# Altium project science_board_proj_rev_1.PrjPcb
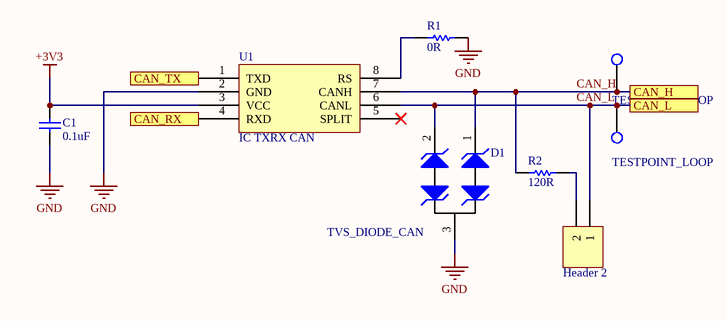
[diagram p0: can.SchDoc]
4 sheets, 88 parts. Net scope: flat (ports and power ports of the same name join across sheets).
Board file: science_board_pcb.PcbDoc
Sheets:
  can.SchDoc
  connectors.SchDoc
  power.SchDoc
  support.SchDoc

## Sheet can.SchDoc: Science Board CAN
size A4

### Parts
1  Header 2  [HDR1X2]
C1  value 0.1uF  [CAPC0603(1608)55_N]  (hidden comment: CAP_0.1uF_16V_0603)
CANH1  TESTPOINT_LOOP  [TESTPOINT_LOOP]
CANL1  TESTPOINT_LOOP  [TESTPOINT_LOOP]
D1  TVS_DIODE_CAN  [TVS_DIODE_CAN]
R1  value 0R  [RESC0603(1608)_N]  (hidden comment: RES_0R_0603)
R2  value 120R  [RESC0603(1608)_N]  (hidden comment: RES_120R_0603)
U1  IC TXRX CAN  [LT-S8_N]

### Ports
CAN_H, CAN_L, CAN_RX, CAN_TX

### Nets
+3V3: C1.2 U1.3(VCC)
GND: C1.1 D1.3 R1.2 U1.2(GND)
CAN_H: CANH1.1(=value) D1.1 R2.1 U1.7(CANH) ; port CAN_H
CAN_L: 1.1 CANL1.1(=value) D1.2 U1.6(CANL) ; port CAN_L
Net1_2: 1.2 R2.2
NetR1_1: R1.1 U1.8(RS)
NetU1_1: U1.1(TXD) ; port CAN_TX
NetU1_4: U1.4(RXD) ; port CAN_RX

Not connected (* = marked no-connect by the designer): U1 5(SPLIT)*

### Library data of the parts
1 = Header 2: Header, 2-Pin; LatestRevisionDate: 17-Jul-2002; LatestRevisionNote: Re-released for DXP Platform.; Publisher: Altium Limited
C1 = CAP_0.1uF_16V_0603: CAP CER 0.1UF 16V X7R 0603; Manufacturer: Yageo; MPN: CC0603KRX7R7BB104; Dimensions: 0.063" L x 0.031" W (1.60mm x 0.80mm); Package: 0603 (1608 Metric); Temperature Coefficient: X7R; Voltage Rating: 16V; Digikey Part Number: 311-1088-1-ND
D1 = TVS_DIODE_CAN: TVS DIODE 24V 41V SOT323-3; Manufacturer: Nexperia USA Inc.; MPN: PESD2CAN,215; Package: SC-70, SOT-323; ComponentLink1Description: Datasheet; ComponentLink1URL: https://assets.nexperia.com/documents/data-sheet/PESD1CAN-U.pdf; Digikey Part Number: 1727-3891-1-ND
R1 = RES_0R_0603: RES SMD 0 OHM JUMPER 1/10W 0603; Manufacturer: Yageo; MPN: RC0603JR-070RL; Package: 0603 (1608 Metric); Dimensions: 0.063" L x 0.031" W (1.60mm x 0.80mm); Digikey Part Number: 311-0.0GRCT-ND
R2 = RES_120R_0603: RES SMD 120 OHM 5% 1/10W 0603; Manufacturer: Yageo; MPN: RC0603JR-07120RL; Package: 0603 (1608 Metric); Dimensions: 0.063" L x 0.031" W (1.60mm x 0.80mm); Tolerance: 5%; Digikey Part Number: 311-120GRCT-ND
U1 = LTC2875: IC TXRX CAN 4MBPS 8SO; Manufacturer: Linear Technologies; MPN: LTC2875IS8#PBF; Package: 8-SOIC (0.154", 3.90mm Width); ComponentLink1Description: Datasheet; ComponentLink1URL: https://www.analog.com/media/en/technical-documentation/data-sheets/2875f.pdf; Digikey Part Number: LTC2875IS8#PBF-ND

## Sheet connectors.SchDoc: Science Board Connectors
size A4; DrawnBy: Adrianna Ascalon
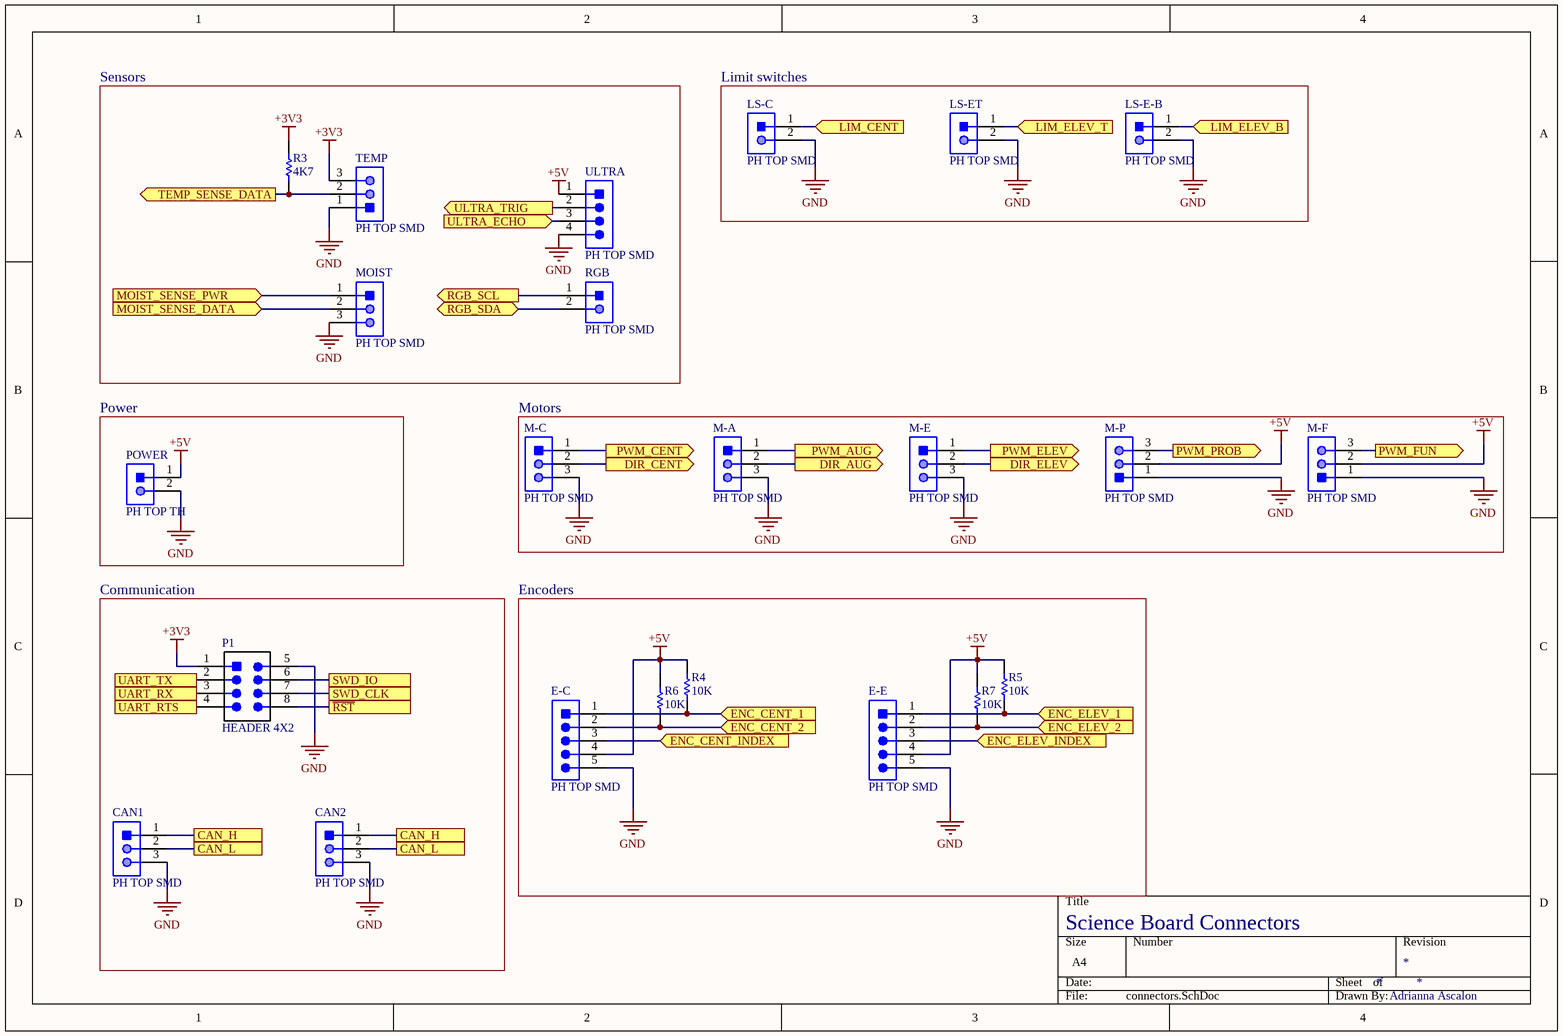
[diagram p1: connectors.SchDoc]

### Parts
CAN1  PH TOP SMD  [JST-B3B-SM4-TB]
CAN2  PH TOP SMD  [JST-B3B-SM4-TB]
E-C  PH TOP SMD  [JST-B5B-SM4-TB]
E-E  PH TOP SMD  [JST-B5B-SM4-TB]
LS-C  PH TOP SMD  [JST-B2B-SM4-TB]
LS-E-B  PH TOP SMD  [JST-B2B-SM4-TB]
LS-ET  PH TOP SMD  [JST-B2B-SM4-TB]
M-A  PH TOP SMD  [JST-B3B-SM4-TB]
M-C  PH TOP SMD  [JST-B3B-SM4-TB]
M-E  PH TOP SMD  [JST-B3B-SM4-TB]
M-F  PH TOP SMD  [JST-B3B-SM4-TB]
M-P  PH TOP SMD  [JST-B3B-SM4-TB]
MOIST  PH TOP SMD  [JST-B3B-SM4-TB]
P1  HEADER 4X2  [HEADER_2X4]
POWER  PH TOP TH  [JST-B2B-PHSK]
R3  value 4K7  [RESC0603(1608)_N]  (hidden comment: RES_4K7_0603)
R4  value 10K  [RESC0603(1608)_N]  (hidden comment: RES_10K_0603)
R5  value 10K  [RESC0603(1608)_N]  (hidden comment: RES_10K_0603)
R6  value 10K  [RESC0603(1608)_N]  (hidden comment: RES_10K_0603)
R7  value 10K  [RESC0603(1608)_N]  (hidden comment: RES_10K_0603)
RGB  PH TOP SMD  [JST-B2B-SM4-TB]
TEMP  PH TOP SMD  [JST-B3B-SM4-TB]
ULTRA  PH TOP SMD  [JST-B4B-SM4-TB]

### Blocks framed on the sheet
Sensors: MOIST R3 RGB TEMP ULTRA
Limit switches: LS-C LS-E-B LS-ET
Power: POWER
Motors: M-A M-C M-E M-F M-P
Communication: CAN1 CAN2 P1
Encoders: E-C E-E R4-R7

### Ports
CAN_H, CAN_L, DIR_AUG (out), DIR_CENT (out), DIR_ELEV (out), ENC_CENT_1 (in), ENC_CENT_2 (in), ENC_CENT_INDEX (in), ENC_ELEV_1 (in), ENC_ELEV_2 (in), ENC_ELEV_INDEX (in), LIM_CENT (in), LIM_ELEV_B (in), LIM_ELEV_T (in), MOIST_SENSE_DATA (in), MOIST_SENSE_PWR (in), PWM_AUG (out), PWM_CENT (out), PWM_ELEV (out), PWM_FUN (out), PWM_PROB (out), RGB_SCL (out), RGB_SDA (bidir), SWD_CLK, SWD_IO, TEMP_SENSE_DATA (out), UART_RTS, UART_RX (in), UART_TX (out), ULTRA_ECHO (in), ULTRA_TRIG (out), ~{RST}

### Nets
+3V3: P1.1(VCC) R3.2 TEMP.3
+5V: E-C.4 E-E.4 M-F.2 M-P.2 POWER.1 R4.2 R5.2 R6.2 R7.2 ULTRA.1
GND: CAN1.3 CAN2.3 E-C.5 E-E.5 LS-C.2 LS-E-B.2 LS-ET.2 M-A.3 M-C.3 M-E.3 M-F.1 M-P.1 MOIST.3 P1.5(GND) POWER.2 TEMP.1 ULTRA.4
CAN_H: CAN1.1 CAN2.1 ; port CAN_H
CAN_L: CAN1.2 CAN2.2 ; port CAN_L
NetE-C_1: E-C.1 R4.1 ; port ENC_CENT_1
NetE-C_2: E-C.2 R6.1 ; port ENC_CENT_2
NetE-C_3: E-C.3 ; port ENC_CENT_INDEX
NetE-E_1: E-E.1 R5.1 ; port ENC_ELEV_1
NetE-E_2: E-E.2 R7.1 ; port ENC_ELEV_2
NetE-E_3: E-E.3 ; port ENC_ELEV_INDEX
NetLS-C_1: LS-C.1 ; port LIM_CENT
NetLS-E-B_1: LS-E-B.1 ; port LIM_ELEV_B
NetLS-ET_1: LS-ET.1 ; port LIM_ELEV_T
NetM-A_1: M-A.1 ; port PWM_AUG
NetM-A_2: M-A.2 ; port DIR_AUG
NetM-C_1: M-C.1 ; port PWM_CENT
NetM-C_2: M-C.2 ; port DIR_CENT
NetM-E_1: M-E.1 ; port PWM_ELEV
NetM-E_2: M-E.2 ; port DIR_ELEV
NetM-F_3: M-F.3 ; port PWM_FUN
NetM-P_3: M-P.3 ; port PWM_PROB
NetMOIST_1: MOIST.1 ; port MOIST_SENSE_PWR
NetMOIST_2: MOIST.2 ; port MOIST_SENSE_DATA
NetP1_2: P1.2 ; port UART_TX
NetP1_3: P1.3 ; port UART_RX
NetP1_4: P1.4 ; port UART_RTS
NetP1_6: P1.6 ; port SWD_IO
NetP1_7: P1.7 ; port SWD_CLK
NetP1_8: P1.8 ; port ~{RST}
NetR3_1: R3.1 TEMP.2 ; port TEMP_SENSE_DATA
NetR17_1: RGB.1 ; port RGB_SCL
NetR18_1: RGB.2 ; port RGB_SDA
NetUE_1: ULTRA.3 ; port ULTRA_ECHO
NetULTRA_2: ULTRA.2 ; port ULTRA_TRIG

### Library data of the parts
CAN1 CAN2 M-A M-C M-E M-F M-P MOIST TEMP = CON_3M_PH_TOP_SMT: CONN HEADER PH TOP 3POS 2MM SMD; Manufacturer: JST; Part Number: B3B-PH-SM4-TB; ComponentLink1Description: Datasheet; ComponentLink1URL: http://www.jst-mfg.com/product/pdf/eng/ePH.pdf
E-C E-E = CON_5M_PH_TOP_SMT: CONN HEADER PH TOP 5POS 2MM SMD; Manufacturer: JST; Part Number: B5B-PH-SM4-TB; ComponentLink1Description: Datasheet; ComponentLink1URL: http://www.jst-mfg.com/product/pdf/eng/ePH.pdf
LS-C LS-E-B LS-ET RGB = CON_2M_PH_TOP_SMT: CONN HEADER PH TOP 2POS 2MM SMD; Manufacturer: JST; Part Number: B2B-PH-SM4-TB; ComponentLink1Description: Datasheet; ComponentLink1URL: http://www.jst-mfg.com/product/pdf/eng/ePH.pdf
P1 = HEADER 4X2: Header, 4-Pin Dual row; MPN: GRPB042VWVN-RC; Manufacturer: Sullins Connector Solutions; Digikey Part Number: S9015E-04-ND
POWER = CON_2M_PH_TOP_TH: CONN HEADER PH TOP 2POS 2MM; Manufacturer: JST; Part Number: B2B-PH-K-S; ComponentLink1Description: Datasheet; ComponentLink1URL: http://www.jst-mfg.com/product/pdf/eng/ePH.pdf
R3 = RES_4K7_0603: RES SMD 4.7K OHM 5% 1/10W 0603; Manufacturer: Yageo; MPN: RC0603JR-074K7L; Package: 0603 (1608 Metric); Dimensions: 0.063" L x 0.031" W (1.60mm x 0.80mm); Tolerance: 5%; Digikey Part Number: 311-4.7KGRCT-ND
R4-R7 = RES_10K_0603: RES SMD 10K OHM 5% 1/10W 0603; Manufacturer: Yageo; MPN: RC0603JR-0710KL; Package: 0603 (1608 Metric); Dimensions: 0.063" L x 0.031" W (1.60mm x 0.80mm); Tolerance: 5%; Digikey Part Number: 311-10KGRCT-ND
ULTRA = CON_4M_PH_TOP_SMT: CONN HEADER PH TOP 4POS 2MM SMD; Manufacturer: JST; Part Number: B4B-PH-SM4-TB; ComponentLink1Description: Datasheet; ComponentLink1URL: http://www.jst-mfg.com/product/pdf/eng/ePH.pdf

## Sheet power.SchDoc: Power
size A4; DrawnBy: Adrianna Ascalon
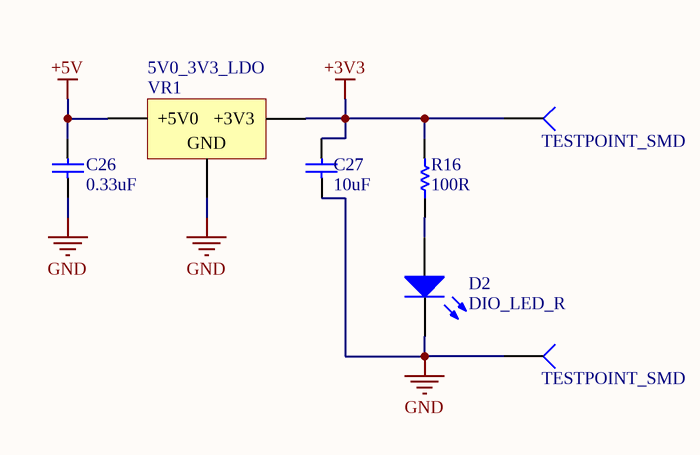
[diagram p2: power.SchDoc]

### Parts
3V3  TESTPOINT_SMD  [TESTPOINT]
C26  value 0.33uF  [CAPC0603(1608)55_N]  (hidden comment: CAP_0.33uF_16V_0603)
C27  10uF  [AVX-CAPC3528_V]
D2  DIO_LED_R  [LED_0805_LINE]
GND  TESTPOINT_SMD  [TESTPOINT]
R16  value 100R  [RESC0603(1608)_N]  (hidden comment: RES_100R_0603)
VR1  5V0_3V3_LDO  [VOLTAGE_REGULATOR]

### Nets
+3V3: 3V3.1(=value) C27.2 R16.2 VR1.2(+3V3)
+5V: C26.2 VR1.3(+5V0)
GND: C26.1 C27.1 D2.2(K) GND.1(=value) VR1.1(GND)
NetD2_1: D2.1(A) R16.1

### Library data of the parts
C26 = CAP_0.33uF_16V_0603: CAP CER 0.33UF 16V X7R 0603; Manufacturer: Murata Electronics North America; MPN: GCM188R71C334KA37D; Dimensions: 0.063" L x 0.031" W (1.60mm x 0.80mm); Package: 0603 (1608 Metric); Temperature Coefficient: X7R; Voltage Rating: 16V; Digikey Part Number: 490-6050-1-ND
C27 = CAP_10uF_0603: CAP CER 10UF 10V X5R 0603; Manufacturer: Yageo; MPN: CC0603MRX5R6BB106; Dimensions: 0.063" L x 0.031" W (1.60mm x 0.80mm); Package: 0603 (1608 Metric); Voltage Rating: 10V; Value: 10uF; Digikey Part Number: 311-1817-1-ND
D2 = DIO_LED_R: LED RED DIFFUSED 0805 SMD; Manufacturer: OSRAM; MPN: LS R976-NR-1; Forward Voltage Drop: 2V; Package: 0805 (2012 Metric); Digikey Part Number: 475-1278-1-ND
R16 = RES_100R_0603: RES SMD 100 OHM 1% 1/10W 0603; Manufacturer: Yageo; MPN: RC0603FR-07100RL; Package: 0603 (1608 Metric); Dimensions: 0.063" L x 0.031" W (1.60mm x 0.80mm); Tolerance: 1%; Digikey Part Number: 311-100HRCT-ND
VR1 = 5V0_3V3_LDO: IC REG LINEAR 3.3V 1A DPAK; Manufacturer: ON Semiconductor; MPN: NCP1117DT33T5G; Current Output: 1A; Digikey Part Number: NCP1117DT33T5GOSCT-ND
3V3 GND = TESTPOINT_SMD: Part Number (MPN): *

## Sheet support.SchDoc: Support
size A4; DrawnBy: Adrianna Ascalon
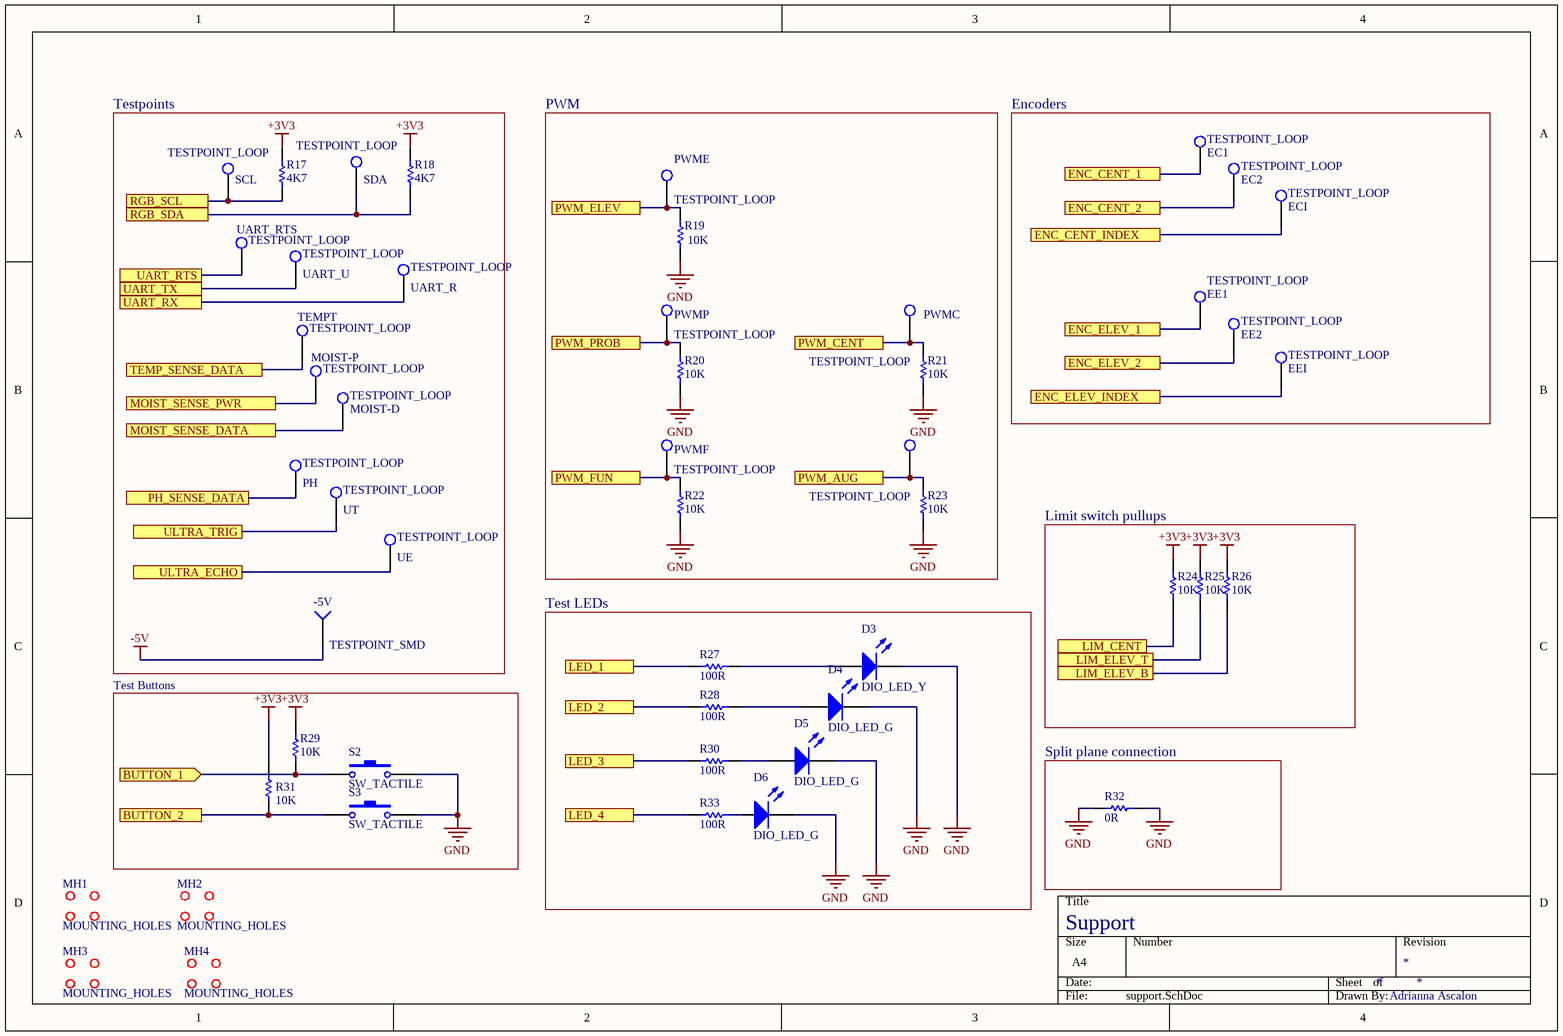
[diagram p3: support.SchDoc]

### Parts
-5V  TESTPOINT_SMD  [TESTPOINT]
D3  DIO_LED_Y  [LED_0805_LINE]
D4  DIO_LED_G  [LED_0805_LINE]
D5  DIO_LED_G  [LED_0805_LINE]
D6  DIO_LED_G  [LED_0805_LINE]
EC1  TESTPOINT_LOOP  [TESTPOINT_LOOP]
EC2  TESTPOINT_LOOP  [TESTPOINT_LOOP]
ECI  TESTPOINT_LOOP  [TESTPOINT_LOOP]
EE1  TESTPOINT_LOOP  [TESTPOINT_LOOP]
EE2  TESTPOINT_LOOP  [TESTPOINT_LOOP]
EEI  TESTPOINT_LOOP  [TESTPOINT_LOOP]
MH1  MOUNTING_HOLES  [MOUNTING_HOLE]
MH2  MOUNTING_HOLES  [MOUNTING_HOLE]
MH3  MOUNTING_HOLES  [MOUNTING_HOLE]
MH4  MOUNTING_HOLES  [MOUNTING_HOLE]
MOIST-D  TESTPOINT_LOOP  [TESTPOINT_LOOP]
MOIST-P  TESTPOINT_LOOP  [TESTPOINT_LOOP]
PH  TESTPOINT_LOOP  [TESTPOINT_LOOP]
PWMA  TESTPOINT_LOOP  [TESTPOINT_LOOP]
PWMC  TESTPOINT_LOOP  [TESTPOINT_LOOP]
PWME  TESTPOINT_LOOP  [TESTPOINT_LOOP]
PWMF  TESTPOINT_LOOP  [TESTPOINT_LOOP]
PWMP  TESTPOINT_LOOP  [TESTPOINT_LOOP]
R17  value 4K7  [RESC0603(1608)_N]  (hidden comment: RES_4K7_0603)
R18  value 4K7  [RESC0603(1608)_N]  (hidden comment: RES_4K7_0603)
R19  value 10K  [RESC0603(1608)_N]  (hidden comment: RES_10K_0603)
R20  value 10K  [RESC0603(1608)_N]  (hidden comment: RES_10K_0603)
R21  value 10K  [RESC0603(1608)_N]  (hidden comment: RES_10K_0603)
R22  value 10K  [RESC0603(1608)_N]  (hidden comment: RES_10K_0603)
R23  value 10K  [RESC0603(1608)_N]  (hidden comment: RES_10K_0603)
R24  value 10K  [RESC0603(1608)_N]  (hidden comment: RES_10K_0603)
R25  value 10K  [RESC0603(1608)_N]  (hidden comment: RES_10K_0603)
R26  value 10K  [RESC0603(1608)_N]  (hidden comment: RES_10K_0603)
R27  value 100R  [RESC0603(1608)_N]  (hidden comment: RES_100R_0603)
R28  value 100R  [RESC0603(1608)_N]  (hidden comment: RES_100R_0603)
R29  value 10K  [RESC0603(1608)_N]  (hidden comment: RES_10K_0603)
R30  value 100R  [RESC0603(1608)_N]  (hidden comment: RES_100R_0603)
R31  value 10K  [RESC0603(1608)_N]  (hidden comment: RES_10K_0603)
R32  value 0R  [RESC0603(1608)_N]  (hidden comment: RES_0R_0603)
R33  value 100R  [RESC0603(1608)_N]  (hidden comment: RES_100R_0603)
S2  SW_TACTILE  [B3U-1100P]
S3  SW_TACTILE  [B3U-1100P]
SCL  TESTPOINT_LOOP  [TESTPOINT_LOOP]
SDA  TESTPOINT_LOOP  [TESTPOINT_LOOP]
TEMPT  TESTPOINT_LOOP  [TESTPOINT_LOOP]
UART_R  TESTPOINT_LOOP  [TESTPOINT_LOOP]
UART_RTS  TESTPOINT_LOOP  [TESTPOINT_LOOP]
UART_U  TESTPOINT_LOOP  [TESTPOINT_LOOP]
UE  TESTPOINT_LOOP  [TESTPOINT_LOOP]
UT  TESTPOINT_LOOP  [TESTPOINT_LOOP]

### Blocks framed on the sheet
Testpoints: -5V MOIST-D MOIST-P PH R17 R18 SCL SDA TEMPT UART_R UART_RTS UART_U UE UT
PWM: PWMA PWMC PWME PWMF PWMP R19-R23
Encoders: EC1 EC2 ECI EE1 EE2 EEI
Limit switch pullups: R24-R26
Test LEDs: D3-D6 R27 R28 R30 R33
Test Buttons: R29 R31 S2 S3
Split plane connection: R32

### Ports
BUTTON_1 (in), BUTTON_2, ENC_CENT_1, ENC_CENT_2, ENC_CENT_INDEX, ENC_ELEV_1, ENC_ELEV_2, ENC_ELEV_INDEX, LED_1, LED_2, LED_3, LED_4, LIM_CENT, LIM_ELEV_B, LIM_ELEV_T, MOIST_SENSE_DATA, MOIST_SENSE_PWR, PH_SENSE_DATA, PWM_AUG, PWM_CENT, PWM_ELEV, PWM_FUN, PWM_PROB, RGB_SCL, RGB_SDA, TEMP_SENSE_DATA, UART_RTS, UART_RX, UART_TX, ULTRA_ECHO, ULTRA_TRIG

### Nets
+3V3: R17.2 R18.2 R24.2 R25.2 R26.2 R29.2 R31.1
-5V: -5V.1(=value)
GND: D3.2(K) D4.2(K) D5.2(K) D6.2(K) R19.1 R20.1 R21.1 R22.1 R23.1 R32.1 R32.2 S2.2 S3.2
NetD3_1: D3.1(A) R27.2
NetD4_1: D4.1(A) R28.2
NetD5_1: D5.1(A) R30.2
NetD6_1: D6.1(A) R33.2
NetE-C_1: EC1.1(=value) ; port ENC_CENT_1
NetE-C_2: EC2.1(=value) ; port ENC_CENT_2
NetE-C_3: ECI.1(=value) ; port ENC_CENT_INDEX
NetE-E_1: EE1.1(=value) ; port ENC_ELEV_1
NetE-E_2: EE2.1(=value) ; port ENC_ELEV_2
NetE-E_3: EEI.1(=value) ; port ENC_ELEV_INDEX
NetLS-C_1: R24.1 ; port LIM_CENT
NetLS-E-B_1: R26.1 ; port LIM_ELEV_B
NetLS-ET_1: R25.1 ; port LIM_ELEV_T
NetM-A_1: PWMA.1(=value) R23.2 ; port PWM_AUG
NetM-C_1: PWMC.1(=value) R21.2 ; port PWM_CENT
NetM-E_1: PWME.1(=value) R19.2 ; port PWM_ELEV
NetM-F_3: PWMF.1(=value) R22.2 ; port PWM_FUN
NetM-P_3: PWMP.1(=value) R20.2 ; port PWM_PROB
NetMOIST_1: MOIST-P.1(=value) ; port MOIST_SENSE_PWR
NetMOIST_2: MOIST-D.1(=value) ; port MOIST_SENSE_DATA
NetP1_2: UART_U.1(=value) ; port UART_TX
NetP1_3: UART_R.1(=value) ; port UART_RX
NetP1_4: UART_RTS.1(=value) ; port UART_RTS
NetPH_1: PH.1(=value) ; port PH_SENSE_DATA
NetR3_1: TEMPT.1(=value) ; port TEMP_SENSE_DATA
NetR17_1: R17.1 SCL.1(=value) ; port RGB_SCL
NetR18_1: R18.1 SDA.1(=value) ; port RGB_SDA
NetR27_1: R27.1 ; port LED_1
NetR28_1: R28.1 ; port LED_2
NetR29_1: R29.1 S2.1 ; port BUTTON_1
NetR30_1: R30.1 ; port LED_3
NetR31_2: R31.2 S3.1 ; port BUTTON_2
NetR33_1: R33.1 ; port LED_4
NetUE_1: UE.1(=value) ; port ULTRA_ECHO
NetULTRA_2: UT.1(=value) ; port ULTRA_TRIG

### Library data of the parts
D3 = DIO_LED_Y: LED YELLOW DIFFUSED 0805 SMD; Manufacturer: OSRAM; MPN: LY R976-PS-36; Forward Voltage Drop: 2.2V; Package: 0805 (2012 Metric); Digikey Part Number: 475-2560-1-ND
D4-D6 = DIO_LED_G: LED GREEN DIFFUSED 0805 SMD; Manufacturer: OSRAM; MPN: LG R971-KN-1; Forward Voltage Drop: 2.2V; Package: 0805 (2012 Metric); Digikey Part Number: 475-1410-1-ND
MH1-MH4 = MOUNTING_HOLES: 6cm x 6cm
R17 R18 = RES_4K7_0603: as R3 on sheet connectors; Package: 0603 (1608 Metric); Dimensions: 0.063" L x 0.031" W (1.60mm x 0.80mm); Tolerance: 5%; Digikey Part Number: 311-4.7KGRCT-ND
R19-R26 R29 R31 = RES_10K_0603: as R4 on sheet connectors; Package: 0603 (1608 Metric); Dimensions: 0.063" L x 0.031" W (1.60mm x 0.80mm); Tolerance: 5%; Digikey Part Number: 311-10KGRCT-ND
R27 R28 R30 R33 = RES_100R_0603: as R16 on sheet power; Package: 0603 (1608 Metric); Dimensions: 0.063" L x 0.031" W (1.60mm x 0.80mm); Tolerance: 1%; Digikey Part Number: 311-100HRCT-ND
R32 = RES_0R_0603: as R1 on sheet can; Package: 0603 (1608 Metric); Dimensions: 0.063" L x 0.031" W (1.60mm x 0.80mm); Digikey Part Number: 311-0.0GRCT-ND
S2 S3 = SW_TACTILE: Tactile Switch (Grey); Manufacturer: Omron Electronics Inc-EMC Div; Digikey Part Number: SW1021TR-ND; MPN: B3U-1100P
-5V = TESTPOINT_SMD: Part Number (MPN): *

## Nets that join several sheets
+3V3: can (C1.2 U1.3), connectors (P1.1 R3.2 TEMP.3), power (3V3.1 C27.2 R16.2 VR1.2), support (7 pins)
+5V: connectors (10 pins), power (C26.2 VR1.3)
GND: can (C1.1 D1.3 R1.2 U1.2), connectors (17 pins), power (5 pins), support (13 pins)
CAN_H: can (CANH1.1 D1.1 R2.1 U1.7), connectors (CAN1.1 CAN2.1)
CAN_L: can (1.1 CANL1.1 D1.2 U1.6), connectors (CAN1.2 CAN2.2)
NetE-C_1: connectors (E-C.1 R4.1), support (EC1.1)
NetE-C_2: connectors (E-C.2 R6.1), support (EC2.1)
NetE-C_3: connectors (E-C.3), support (ECI.1)
NetE-E_1: connectors (E-E.1 R5.1), support (EE1.1)
NetE-E_2: connectors (E-E.2 R7.1), support (EE2.1)
NetE-E_3: connectors (E-E.3), support (EEI.1)
NetLS-C_1: connectors (LS-C.1), support (R24.1)
NetLS-E-B_1: connectors (LS-E-B.1), support (R26.1)
NetLS-ET_1: connectors (LS-ET.1), support (R25.1)
NetM-A_1: connectors (M-A.1), support (PWMA.1 R23.2)
NetM-C_1: connectors (M-C.1), support (PWMC.1 R21.2)
NetM-E_1: connectors (M-E.1), support (PWME.1 R19.2)
NetM-F_3: connectors (M-F.3), support (PWMF.1 R22.2)
NetM-P_3: connectors (M-P.3), support (PWMP.1 R20.2)
NetMOIST_1: connectors (MOIST.1), support (MOIST-P.1)
NetMOIST_2: connectors (MOIST.2), support (MOIST-D.1)
NetP1_2: connectors (P1.2), support (UART_U.1)
NetP1_3: connectors (P1.3), support (UART_R.1)
NetP1_4: connectors (P1.4), support (UART_RTS.1)
NetR3_1: connectors (R3.1 TEMP.2), support (TEMPT.1)
NetR17_1: connectors (RGB.1), support (R17.1 SCL.1)
NetR18_1: connectors (RGB.2), support (R18.1 SDA.1)
NetUE_1: connectors (ULTRA.3), support (UE.1)
NetULTRA_2: connectors (ULTRA.2), support (UT.1)